# Altium schematic sheet Power_MPU.SchDoc: Power_MPU
size A3; CompanyName: STMicroelectronics; SheetNumber: 4; SheetTotal: 7
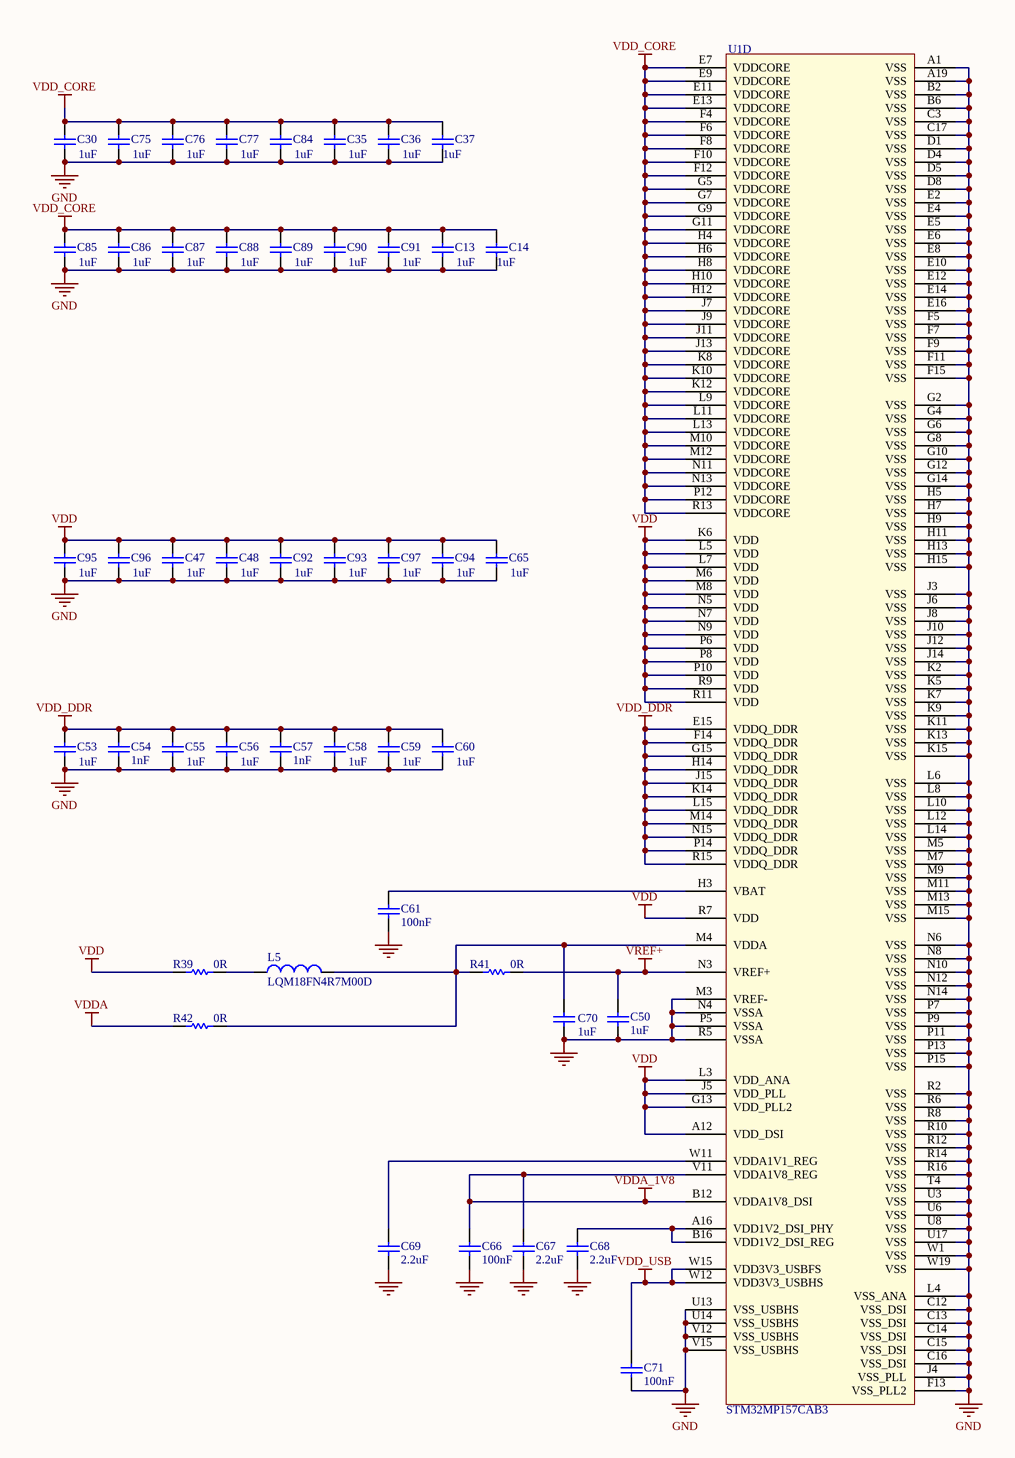
[diagram p0: Power_MPU.SchDoc]

## Parts
C13  value 1uF  [C0402]
C14  value 1uF  [C0402]
C30  value 1uF  [C0402]
C35  value 1uF  [C0402]
C36  value 1uF  [C0402]
C37  value 1uF  [C0402]
C47  value 1uF  [C0402]
C48  value 1uF  [C0402]
C50  value 1uF  [C0402]
C53  value 1uF  [C0402]
C54  value 1nF  [C0402]
C55  value 1uF  [C0402]
C56  value 1uF  [C0402]
C57  value 1nF  [C0402]
C58  value 1uF  [C0402]
C59  value 1uF  [C0402]
C60  value 1uF  [C0402]
C61  value 100nF  [C0402]
C65  value 1uF  [C0402]
C66  value 100nF  [C0402]
C67  value 2.2uF  [C0402]  (hidden comment: Capacitor)
C68  value 2.2uF  [C0402]  (hidden comment: Capacitor)
C69  value 2.2uF  [C0402]  (hidden comment: Capacitor)
C70  value 1uF  [C0402]
C71  value 100nF  [C0402]
C75  value 1uF  [C0402]
C76  value 1uF  [C0402]
C77  value 1uF  [C0402]
C84  value 1uF  [C0402]
C85  value 1uF  [C0402]
C86  value 1uF  [C0402]
C87  value 1uF  [C0402]
C88  value 1uF  [C0402]
C89  value 1uF  [C0402]
C90  value 1uF  [C0402]
C91  value 1uF  [C0402]
C92  value 1uF  [C0402]
C93  value 1uF  [C0402]
C94  value 1uF  [C0402]
C95  value 1uF  [C0402]
C96  value 1uF  [C0402]
C97  value 1uF  [C0402]
L5  value LQM18FN4R7M00D  [L0603_H0P8]
R39  value 0R  [R0402]
R41  value 0R  [R0402]
R42  value 0R  [R0402]
U1  value STM32MP157CAB3  [ICC_LFBGA354_16X16_STM32MP157CAB3_P080]  (part D of 5)

## Nets
GND: C13.1 C14.1 C30.1 C35.1 C36.1 C37.1 C47.1 C48.1 C50.1 C53.1 C54.1 C55.1 C56.1 C57.1 C58.1 C59.1 C60.1 C61.1 C65.1 C66.1 C67.1 C68.1 C69.1 C70.1 C71.1 C75.1 C76.1 C77.1 C84.1 C85.1 C86.1 C87.1 C88.1 C89.1 C90.1 C91.1 C92.1 C93.1 C94.1 C95.1 C96.1 C97.1 U1.A1(VSS) U1.A19(VSS) U1.B2(VSS) U1.B6(VSS) U1.C3(VSS) U1.C12(VSS_DSI) U1.C13(VSS_DSI) U1.C14(VSS_DSI) U1.C15(VSS_DSI) U1.C16(VSS_DSI) U1.C17(VSS) U1.D1(VSS) U1.D4(VSS) U1.D5(VSS) U1.D8(VSS) U1.E2(VSS) U1.E4(VSS) U1.E5(VSS) U1.E6(VSS) U1.E8(VSS) U1.E10(VSS) U1.E12(VSS) U1.E14(VSS) U1.E16(VSS) U1.F5(VSS) U1.F7(VSS) U1.F9(VSS) U1.F11(VSS) U1.F13(VSS_PLL2) U1.F15(VSS) U1.G2(VSS) U1.G4(VSS) U1.G6(VSS) U1.G8(VSS) U1.G10(VSS) U1.G12(VSS) U1.G14(VSS) U1.H5(VSS) U1.H7(VSS) U1.H9(VSS) U1.H11(VSS) U1.H13(VSS) U1.H15(VSS) U1.J3(VSS) U1.J4(VSS_PLL) U1.J6(VSS) U1.J8(VSS) U1.J10(VSS) U1.J12(VSS) U1.J14(VSS) U1.K2(VSS) U1.K5(VSS) U1.K7(VSS) U1.K9(VSS) U1.K11(VSS) U1.K13(VSS) U1.K15(VSS) U1.L4(VSS_ANA) U1.L6(VSS) U1.L8(VSS) U1.L10(VSS) U1.L12(VSS) U1.L14(VSS) U1.M3(VREF-) U1.M5(VSS) U1.M7(VSS) U1.M9(VSS) U1.M11(VSS) U1.M13(VSS) U1.M15(VSS) U1.N4(VSSA) U1.N6(VSS) U1.N8(VSS) U1.N10(VSS) U1.N12(VSS) U1.N14(VSS) U1.P5(VSSA) U1.P7(VSS) U1.P9(VSS) U1.P11(VSS) U1.P13(VSS) U1.P15(VSS) U1.R2(VSS) U1.R5(VSSA) U1.R6(VSS) U1.R8(VSS) U1.R10(VSS) U1.R12(VSS) U1.R14(VSS) U1.R16(VSS) U1.T4(VSS) U1.U3(VSS) U1.U6(VSS) U1.U8(VSS) U1.U13(VSS_USBHS) U1.U14(VSS_USBHS) U1.U17(VSS) U1.V12(VSS_USBHS) U1.V15(VSS_USBHS) U1.W1(VSS) U1.W19(VSS)
VDD: C47.2 C48.2 C65.2 C92.2 C93.2 C94.2 C95.2 C96.2 C97.2 R39.1 U1.A12(VDD_DSI) U1.G13(VDD_PLL2) U1.J5(VDD_PLL) U1.K6(VDD) U1.L3(VDD_ANA) U1.L5(VDD) U1.L7(VDD) U1.M6(VDD) U1.M8(VDD) U1.N5(VDD) U1.N7(VDD) U1.N9(VDD) U1.P6(VDD) U1.P8(VDD) U1.P10(VDD) U1.R7(VDD) U1.R9(VDD) U1.R11(VDD)
VDD_CORE: C13.2 C14.2 C30.2 C35.2 C36.2 C37.2 C75.2 C76.2 C77.2 C84.2 C85.2 C86.2 C87.2 C88.2 C89.2 C90.2 C91.2 U1.E7(VDDCORE) U1.E9(VDDCORE) U1.E11(VDDCORE) U1.E13(VDDCORE) U1.F4(VDDCORE) U1.F6(VDDCORE) U1.F8(VDDCORE) U1.F10(VDDCORE) U1.F12(VDDCORE) U1.G5(VDDCORE) U1.G7(VDDCORE) U1.G9(VDDCORE) U1.G11(VDDCORE) U1.H4(VDDCORE) U1.H6(VDDCORE) U1.H8(VDDCORE) U1.H10(VDDCORE) U1.H12(VDDCORE) U1.J7(VDDCORE) U1.J9(VDDCORE) U1.J11(VDDCORE) U1.J13(VDDCORE) U1.K8(VDDCORE) U1.K10(VDDCORE) U1.K12(VDDCORE) U1.L9(VDDCORE) U1.L11(VDDCORE) U1.L13(VDDCORE) U1.M10(VDDCORE) U1.M12(VDDCORE) U1.N11(VDDCORE) U1.N13(VDDCORE) U1.P12(VDDCORE) U1.R13(VDDCORE)
VDD_DDR: C53.2 C54.2 C55.2 C56.2 C57.2 C58.2 C59.2 C60.2 U1.E15(VDDQ_DDR) U1.F14(VDDQ_DDR) U1.G15(VDDQ_DDR) U1.H14(VDDQ_DDR) U1.J15(VDDQ_DDR) U1.K14(VDDQ_DDR) U1.L15(VDDQ_DDR) U1.M14(VDDQ_DDR) U1.N15(VDDQ_DDR) U1.P14(VDDQ_DDR) U1.R15(VDDQ_DDR)
VDD_USB: C71.2 U1.W12(VDD3V3_USBHS) U1.W15(VDD3V3_USBFS)
VDDA: R42.1
VDDA_1V8: C66.2 C67.2 U1.B12(VDDA1V8_DSI) U1.V11(VDDA1V8_REG)
VREF+: C50.2 R41.2 U1.N3(VREF+)
NetC61_2: C61.2 U1.H3(VBAT)
NetC68_2: C68.2 U1.A16(VDD1V2_DSI_PHY) U1.B16(VDD1V2_DSI_REG)
NetC69_2: C69.2 U1.W11(VDDA1V1_REG)
NetC70_2: C70.2 L5.2 R41.1 R42.2 U1.M4(VDDA)
NetL5_1: L5.1 R39.2

## Notes on the sheet
- Title:
- Project:
- Size:
- Revision:
- Variant:
- A3
- -
- Date:
- Reference:
- Sheet:
- of

## Library data of the parts
C13 C14 C30 C35-C37 C47 C48 C50 C53 C55 C56 C58-C60 C65 C70 C75-C77 C84-C97 = MCD-00095: Capacitor, MLCC, 1uF, 6V3, X5R, 10%, 0402, T=0,5mm; Manufacturer_Part_Number: GRM155R61E105KA12; Manufacturer: MURATA; Alternate_Manufacturer_Part_Number: GRM155R60J105KE19; Provided_By: SUBCO; ECCN_US: EAR99; ECCN_EU: NEC; Internal_Part_Number: MCD-00095; Status: Released; Package: C0402; ComponentLink1Description: Datasheet; Part_Type: Capacitor; Alternate_Manufacturer: MURATA; ComponentLink1URL: http://tunmcdsvn.tun.st.com/Component_Datasheet_Library/Trunk/Capacitors/Murata_Capacitor_GR_series
C54 C57 = MCD-00198: Capacitor, MLCC, 1nF, 16V, X7R, 10%, 0402, T=0.5mm; Manufacturer_Part_Number: CC0402KRX7R7BB102; Manufacturer: YAGEO; Provided_By: SUBCO; ECCN_US: EAR99; ECCN_EU: NEC; Internal_Part_Number: MCD-00198; Status: Released; Part_Type: Capacitor; Package: C0402; ComponentLink1Description: Datasheet; ComponentLink1URL: http://tunmcdsvn.tun.st.com/Component_Datasheet_Library/Trunk/Capacitors/Yageo_Multilayer_Capacitor_X7R_series_100pF_to_22uF
C61 C66 C71 = MCD-00006: Capacitor, MLCC, 100nF, 16V, X7R, 10%, 0402, T=0.5mm; Manufacturer_Part_Number: CC0402KRX7R7BB104; Manufacturer: YAGEO; Alternate_Manufacturer_Part_Number: GCM155R71C104KA55D; Alternate_Manufacturer: MURATA; Provided_By: SUBCO; ECCN_US: EAR99; ECCN_EU: NEC; Internal_Part_Number: MCD-00006; ComponentLink1Description: Datasheet; Status: Released; Part_Type: Capacitor; Package: C0402; ComponentLink1URL: http://tunmcdsvn.tun.st.com/Component_Datasheet_Library/Trunk/Capacitors/Yageo_Multilayer_Capacitor_X7R_series_100pF_to_22uF
C67-C69 = MCD-01823: Capacitor,MLCC,2.2uF,6V3,X5R,10%,0402,T=0.5; Manufacturer_Part_Number: GRM155R60J225KE95D; Manufacturer: MURATA; ECCN_US: EAR99; ECCN_EU: NEC; Provided_By: SUBCO; Internal_Part_Number: MCD-01823; Status: Checked; Part_Type: Capacitor; Package: C0402; ComponentLink1Description: Datasheet; ComponentLink1URL: http://tunmcdsvn.tun.st.com/Component_Datasheet_Library/Trunk/Capacitors/Murata_Capacitor_GR_series
L5 = MCD-01134: IND 4.7uH 20% 80mA 600mhom 0603; Part_Type: Inductor; Manufacturer: MURATA; Provided_By: SUBCO; Internal_Part_Number: MCD-01134; Status: Footprint available; Manufacturer_Part_Number: LQM18FN4R7M00D; Package: 0603; ComponentLink1Description: Datasheet; ComponentLink1URL: http://tunmcdsvn.tun.st.com/Component_Datasheet_Library/Trunk/Inductors/Murata_inductor_LQM18FN4R7M00D; ECCN_US: n/a; ECCN_EU: n/a
R39 R41 R42 = MCD-00052: Resistor,0R,0402,5%,1/16W; Manufacturer_Part_Number: RC0402JR-070RL; Manufacturer: YAGEO; Provided_By: SUBCO; ECCN_US: EAR99; ECCN_EU: NEC; Internal_Part_Number: MCD-00052; Status: Released; Part_Type: Resistor; ComponentLink1Description: Datasheet; ComponentLink1URL: http://tunmcdsvn.tun.st.com/Component_Datasheet_Library/Trunk/Resistors/Yageo_Resistor_RC0402-series; Package: R0402
U1 = MCD-01805: MPU LFBGA 16x16x1.271 PITCH 0.8 mm secure boot + crypto; Part_Type: IC; Manufacturer: STMICROELECTRONICS; ECCN_US: 5A002A4; ECCN_EU: NEC; Provided_By: SUBCO with ST control; Internal_Part_Number: MCD-01805; Status: Checked; Manufacturer_Part_Number: STM32MP157CAB3; Package: LFBGA; ComponentLink1Description: Datasheet; ComponentLink1URL: TBD